# EAGLE schematic Freezer (EAGLE 7.5.0)
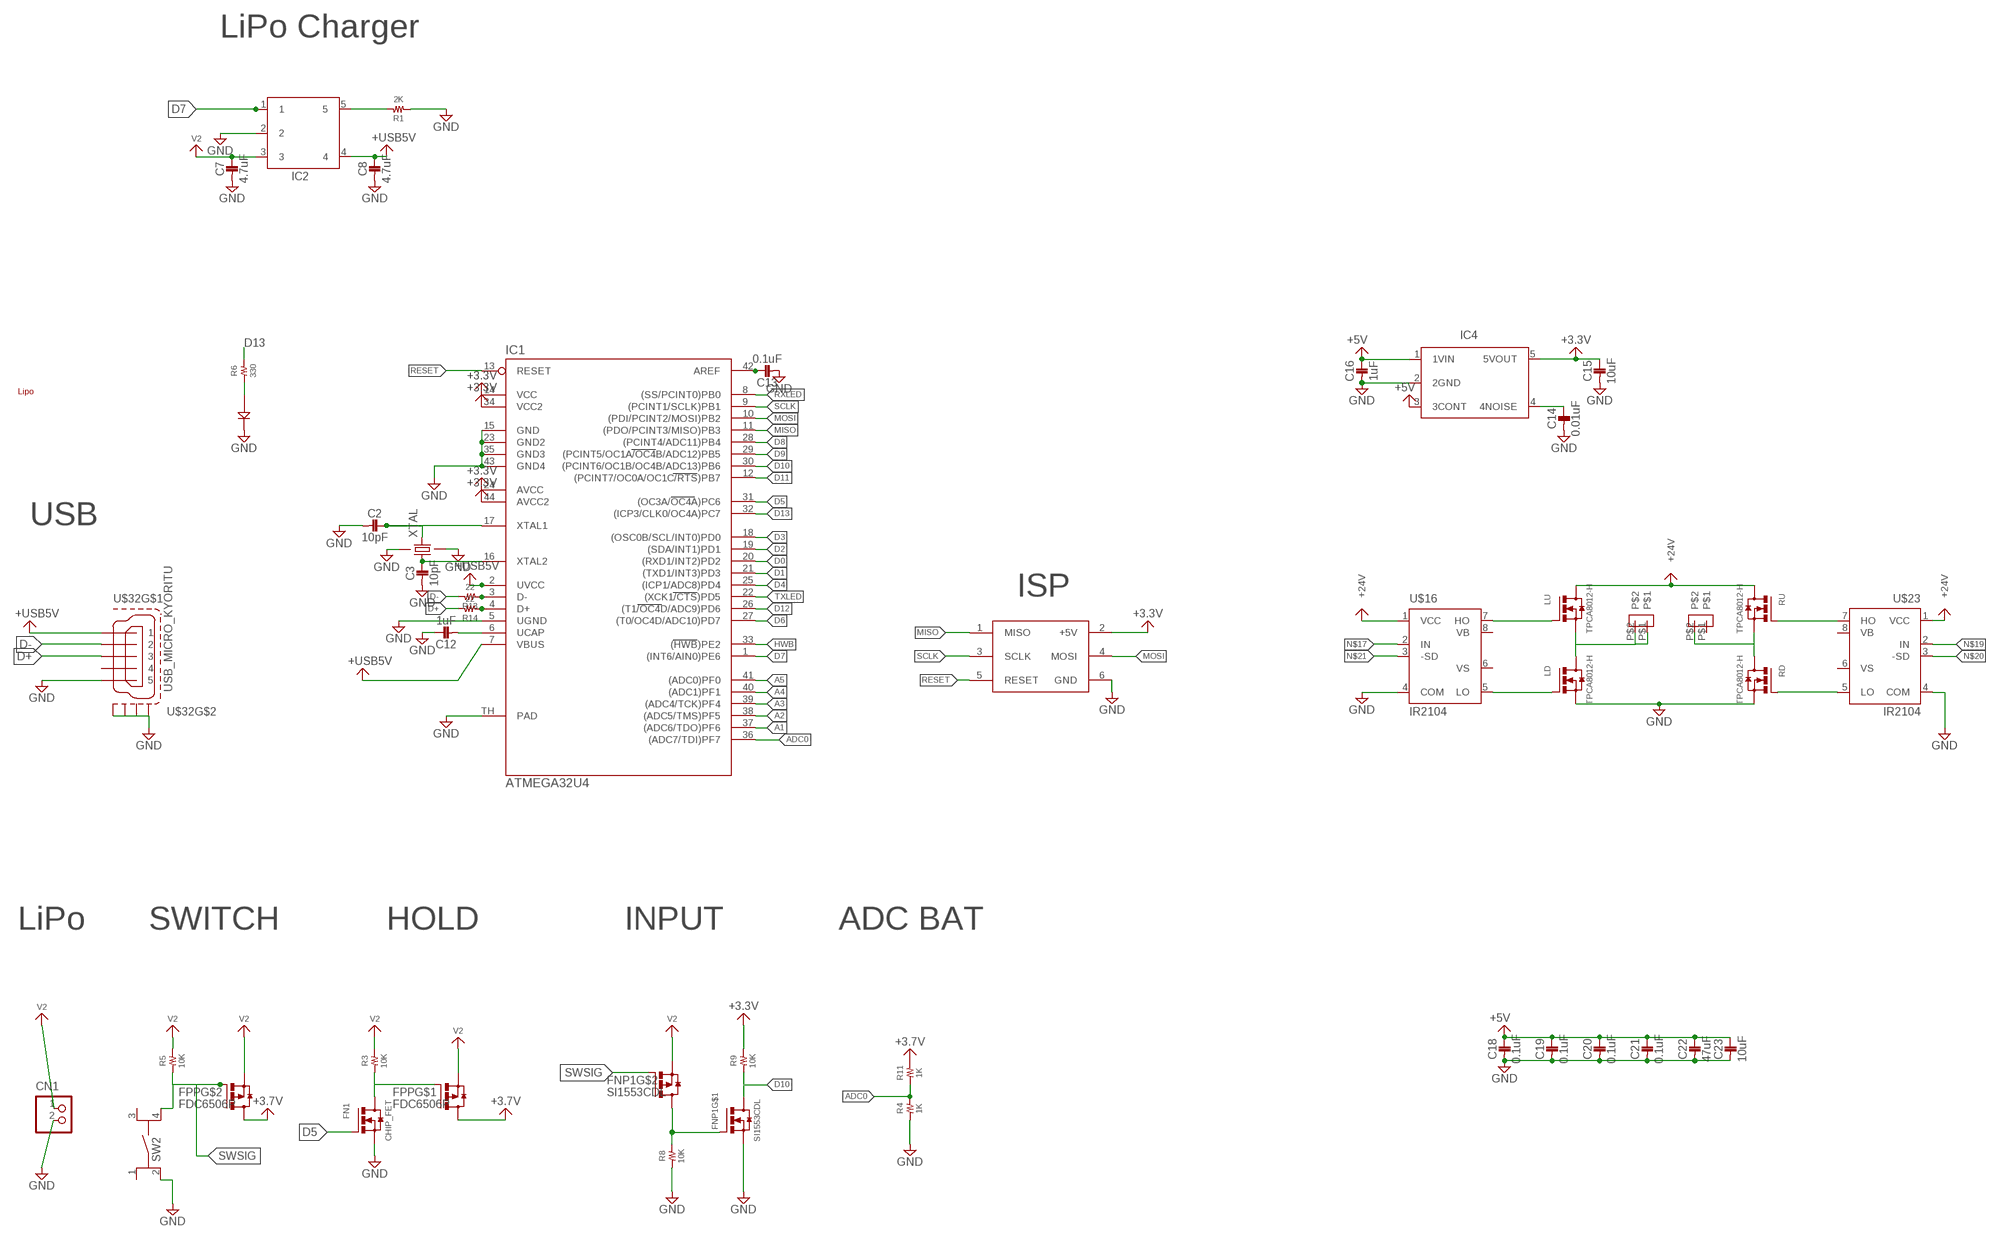
[diagram p0: schematic, sheet 1]

## Parts
C2  10pF  1005  [1005]
C3  10pF  1005  [1005]
C7  4.7uF  1005  [1005]
C8  4.7uF  1005  [1005]
C12  1uF  1005  [1005]
C13  0.1uF  1005  [1005]
C14  0.01uF  1608  [1608]
C15  10uF  1608  [1608]
C16  1uF  1005  [1005]
C18  0.1uF  1005  [1005]
C19  0.1uF  1005  [1005]
C20  0.1uF  1005  [1005]
C21  0.1uF  1005  [1005]
C22  47uF  1608  [1608]
C23  10uF  1608  [1608]
CN1  S2B-PH-K-S  [S2B-PH-K-S]
FN1  CHIP_FET  [SOT23]
FNP1  SI1553CDL  [SOT363]
FPP  FDC6506P  [SOT23-6]
IC1  ATMEGA32U4  [QFN-44-7X7]
IC2  MCP73831  [SOT23-5L]
IC4  TAR5SB  [SSOP5-P-0.95]
LD  TPCA8012-H  [2-5Q1A]
LED1  1608  [1608]
LU  TPCA8012-H  [2-5Q1A]
R1  2K  RESISTOR_1005  [1005]
R3  10K  RESISTOR_1005  [1005]
R4  1K  RESISTOR_1005  [1005]
R5  10K  RESISTOR_1005  [1005]
R6  330  RESISTOR_1005  [1005]
R8  10K  RESISTOR_1005  [1005]
R9  10K  RESISTOR_1005  [1005]
R11  1K  RESISTOR_1005  [1005]
R13  22  RESISTOR_1005  [1005]
R14  22  RESISTOR_1005  [1005]
RD  TPCA8012-H  [2-5Q1A]
RU  TPCA8012-H  [2-5Q1A]
SW2  SKRPACE010  [SKRP]
U$3  ICSP  [ICSP]
U$16  IR2104  [SOIC8]
U$23  IR2104  [SOIC8]
U$32  USB_MICRO_KYORITU  [USB_MICRO_KYORITU]
U$38  TERMINAL_2P  [TERMINAL_2P]
U$43  TERMINAL_2P  [TERMINAL_2P]
U$68  LIPO500MAH  [LIPO500MAH]
XTAL  FA-238  [FA-238]

## Nets
+3.3V: C15.P$1 IC1.14(VCC) IC1.24(AVCC) IC1.34(VCC2) IC1.44(AVCC2) IC4.5(5VOUT) R9.2 U$3.2(+5V)
+3.7V: FPP.4(D) FPP.6(D) R11.2
+5V: C16.1 C18.1 C19.1 C20.1 C21.1 C22.P$1 C23.P$1 IC4.1(1VIN) IC4.3(3CONT)
+24V: LU.5(D) LU.6(D) LU.7(D) LU.8(D) RU.5(D) RU.6(D) RU.7(D) RU.8(D) U$16.1(VCC) U$23.1(VCC)
+USB5V: C8.1 IC1.2(UVCC) IC1.7(VBUS) IC2.4 U$32.1
A1: IC1.37((ADC6/TDO)PF6)
A2: IC1.38((ADC5/TMS)PF5)
A3: IC1.39((ADC4/TCK)PF4)
A4: IC1.40((ADC1)PF1)
A5: IC1.41((ADC0)PF0)
ADC0: IC1.36((ADC7/TDI)PF7) R4.2 R11.1
D0: IC1.20((RXD1/INT2)PD2)
D1: IC1.21((TXD1/INT3)PD3)
D2: IC1.19((SDA/INT1)PD1)
D3: IC1.18((OSC0B/SCL/INT0)PD0)
D4: IC1.25((ICP1/ADC8)PD4)
D5: FN1.1(G) IC1.31((OC3A/OC4A)PC6)
D6: IC1.27((T0/OC4D/ADC10)PD7)
D7: IC1.1((INT6/AIN0)PE6) IC2.1
D8: IC1.28((PCINT4/ADC11)PB4)
D9: IC1.29((PCINT5/OC1A/OC4B/ADC12)PB5)
D10: FNP1.6(D) IC1.30((PCINT6/OC1B/OC4B/ADC13)PB6) R9.1
D11: IC1.12((PCINT7/OC0A/OC1C/RTS)PB7)
D12: IC1.26((T1/OC4D/ADC9)PD6)
D13: IC1.32((ICP3/CLK0/OC4A)PC7) R6.2
D+: R14.2 U$32.3
D-: R13.2 U$32.2
GND: C2.2 C3.2 C7.2 C8.2 C12.1 C13.2 C14.P$2 C15.P$2 C16.2 C18.2 C19.2 C20.2 C21.2 C22.P$2 C23.P$2 CN1.2 FN1.2(S) FNP1.1(S) IC1.5(UGND) IC1.15(GND) IC1.23(GND2) IC1.35(GND3) IC1.43(GND4) IC1.TH(PAD) IC2.2 IC4.2(2GND) LD.1(S) LD.2(S) LD.3(S) LED1.2(K) R1.1 R4.1 R8.1 RD.1(S) RD.2(S) RD.3(S) SW2.2(1_) U$3.6(GND) U$16.4(COM) U$23.4(COM) U$32.5 U$32.M1(S1) U$32.M2(S2) U$32.M3(S3) U$32.M4(S4) XTAL.2 XTAL.4
HWB: IC1.33((HWB)PE2)
MISO: IC1.11((PDO/PCINT3/MISO)PB3) U$3.1(MISO)
MOSI: IC1.10((PDI/PCINT2/MOSI)PB2) U$3.4(MOSI)
N$1: LED1.1(A) R6.1
N$2: IC2.5 R1.2
N$4: RU.4(G) U$23.7(HO)
N$6: FN1.3(D) FPP.1(G) R3.1
N$7: C3.1 IC1.16(XTAL2) XTAL.1
N$8: IC1.3(D-) R13.1
N$9: C13.1 IC1.42(AREF)
N$10: C2.1 IC1.17(XTAL1) XTAL.3
N$12: RD.4(G) U$23.5(LO)
N$13: LU.4(G) U$16.7(HO)
N$14: IC1.4(D+) R14.1
N$15: LD.4(G) U$16.5(LO)
N$16: C14.P$1 IC4.4(4NOISE)
N$17: U$16.2(IN)
N$18: C12.2 IC1.6(UCAP)
N$19: U$23.2(IN)
N$20: U$23.3(-SD)
N$21: U$16.3(-SD)
P+: LD.5(D) LD.6(D) LD.7(D) LD.8(D) LU.1(S) LU.2(S) LU.3(S) U$38.P$1 U$38.P$2
P-: RD.5(D) RD.6(D) RD.7(D) RD.8(D) RU.1(S) RU.2(S) RU.3(S) U$43.P$2
RESET: IC1.13(RESET) U$3.5(RESET)
RXLED: IC1.8((SS/PCINT0)PB0)
SCLK: IC1.9((PCINT1/SCLK)PB1) U$3.3(SCLK)
SIG: FNP1.2(G) FNP1.3(D) R8.2
SWSIG: FNP1.5(G) FPP.3(G) R5.1 SW2.4(2_)
TXLED: IC1.22((XCK1/CTS)PD5)
V2: C7.1 CN1.1 FNP1.4(S) FPP.2(S) FPP.5(S) IC2.3 R3.2 R5.2
Unconnected: SW2.1 SW2.3 U$16.6(VS) U$16.8(VB) U$23.6(VS) U$23.8(VB) U$32.4 U$43.P$1

## Notes on the sheet
- LiPo Charger
- USB
- ISP
- LiPo | SWITCH | HOLD | INPUT | ADC BAT

## Library data of the parts
C2 C3 C7 C8 C12 C13 C16 C18-C21 = 02_C:1005
C14 C15 C22 C23 = 02_C:1608
CN1 = jst-ph1:S2B-PH-*: Wire-to-Board 2.0mm pitch side mount connector Source: http://www.jst-mfg.com/product/pdf/jpn/PH.pdf http://www.jst-mfg.com/product/detail.php?series=199
FN1 = 06_FET:CHIP_FET
FNP1 = 06_FET:SI1553CDL
FPP = 06_FET:FDC6506P
IC1 = 04_IC:ATMEGA32U4
IC2 = 04_IC:MCP73831
IC4 = 04_IC:TAR5SB
LD LU RD RU = 06_FET:TPCA8012-H
LED1 = 10_LED:1608
R1 R3-R6 R8 R9 R11 R13 R14 = 01_R:RESISTOR_1005
SW2 = 09_1_switch:SKRPACE010
U$3 = 08_CONECTOR:ICSP
U$16 U$23 = 04_IC:IR2104
U$32 = 08_CONECTOR:USB_MICRO_KYORITU
U$38 U$43 = 08_CONECTOR:TERMINAL_2P
U$68 = 16_battery:LIPO500MAH
XTAL = 09_2_CRYSTAL:FA-238

## Net classes
1 POWER: width 0.5 mm, clearance 0.5 mm